# EasyEDA schematic 1-Schematic_final 7.3d.json
TITLE: Sheet_1; REV: 1.0; Date: 2021-05-28; Sheet: 1/1; Drawn By: Kushan Arampath; Company: Your Company
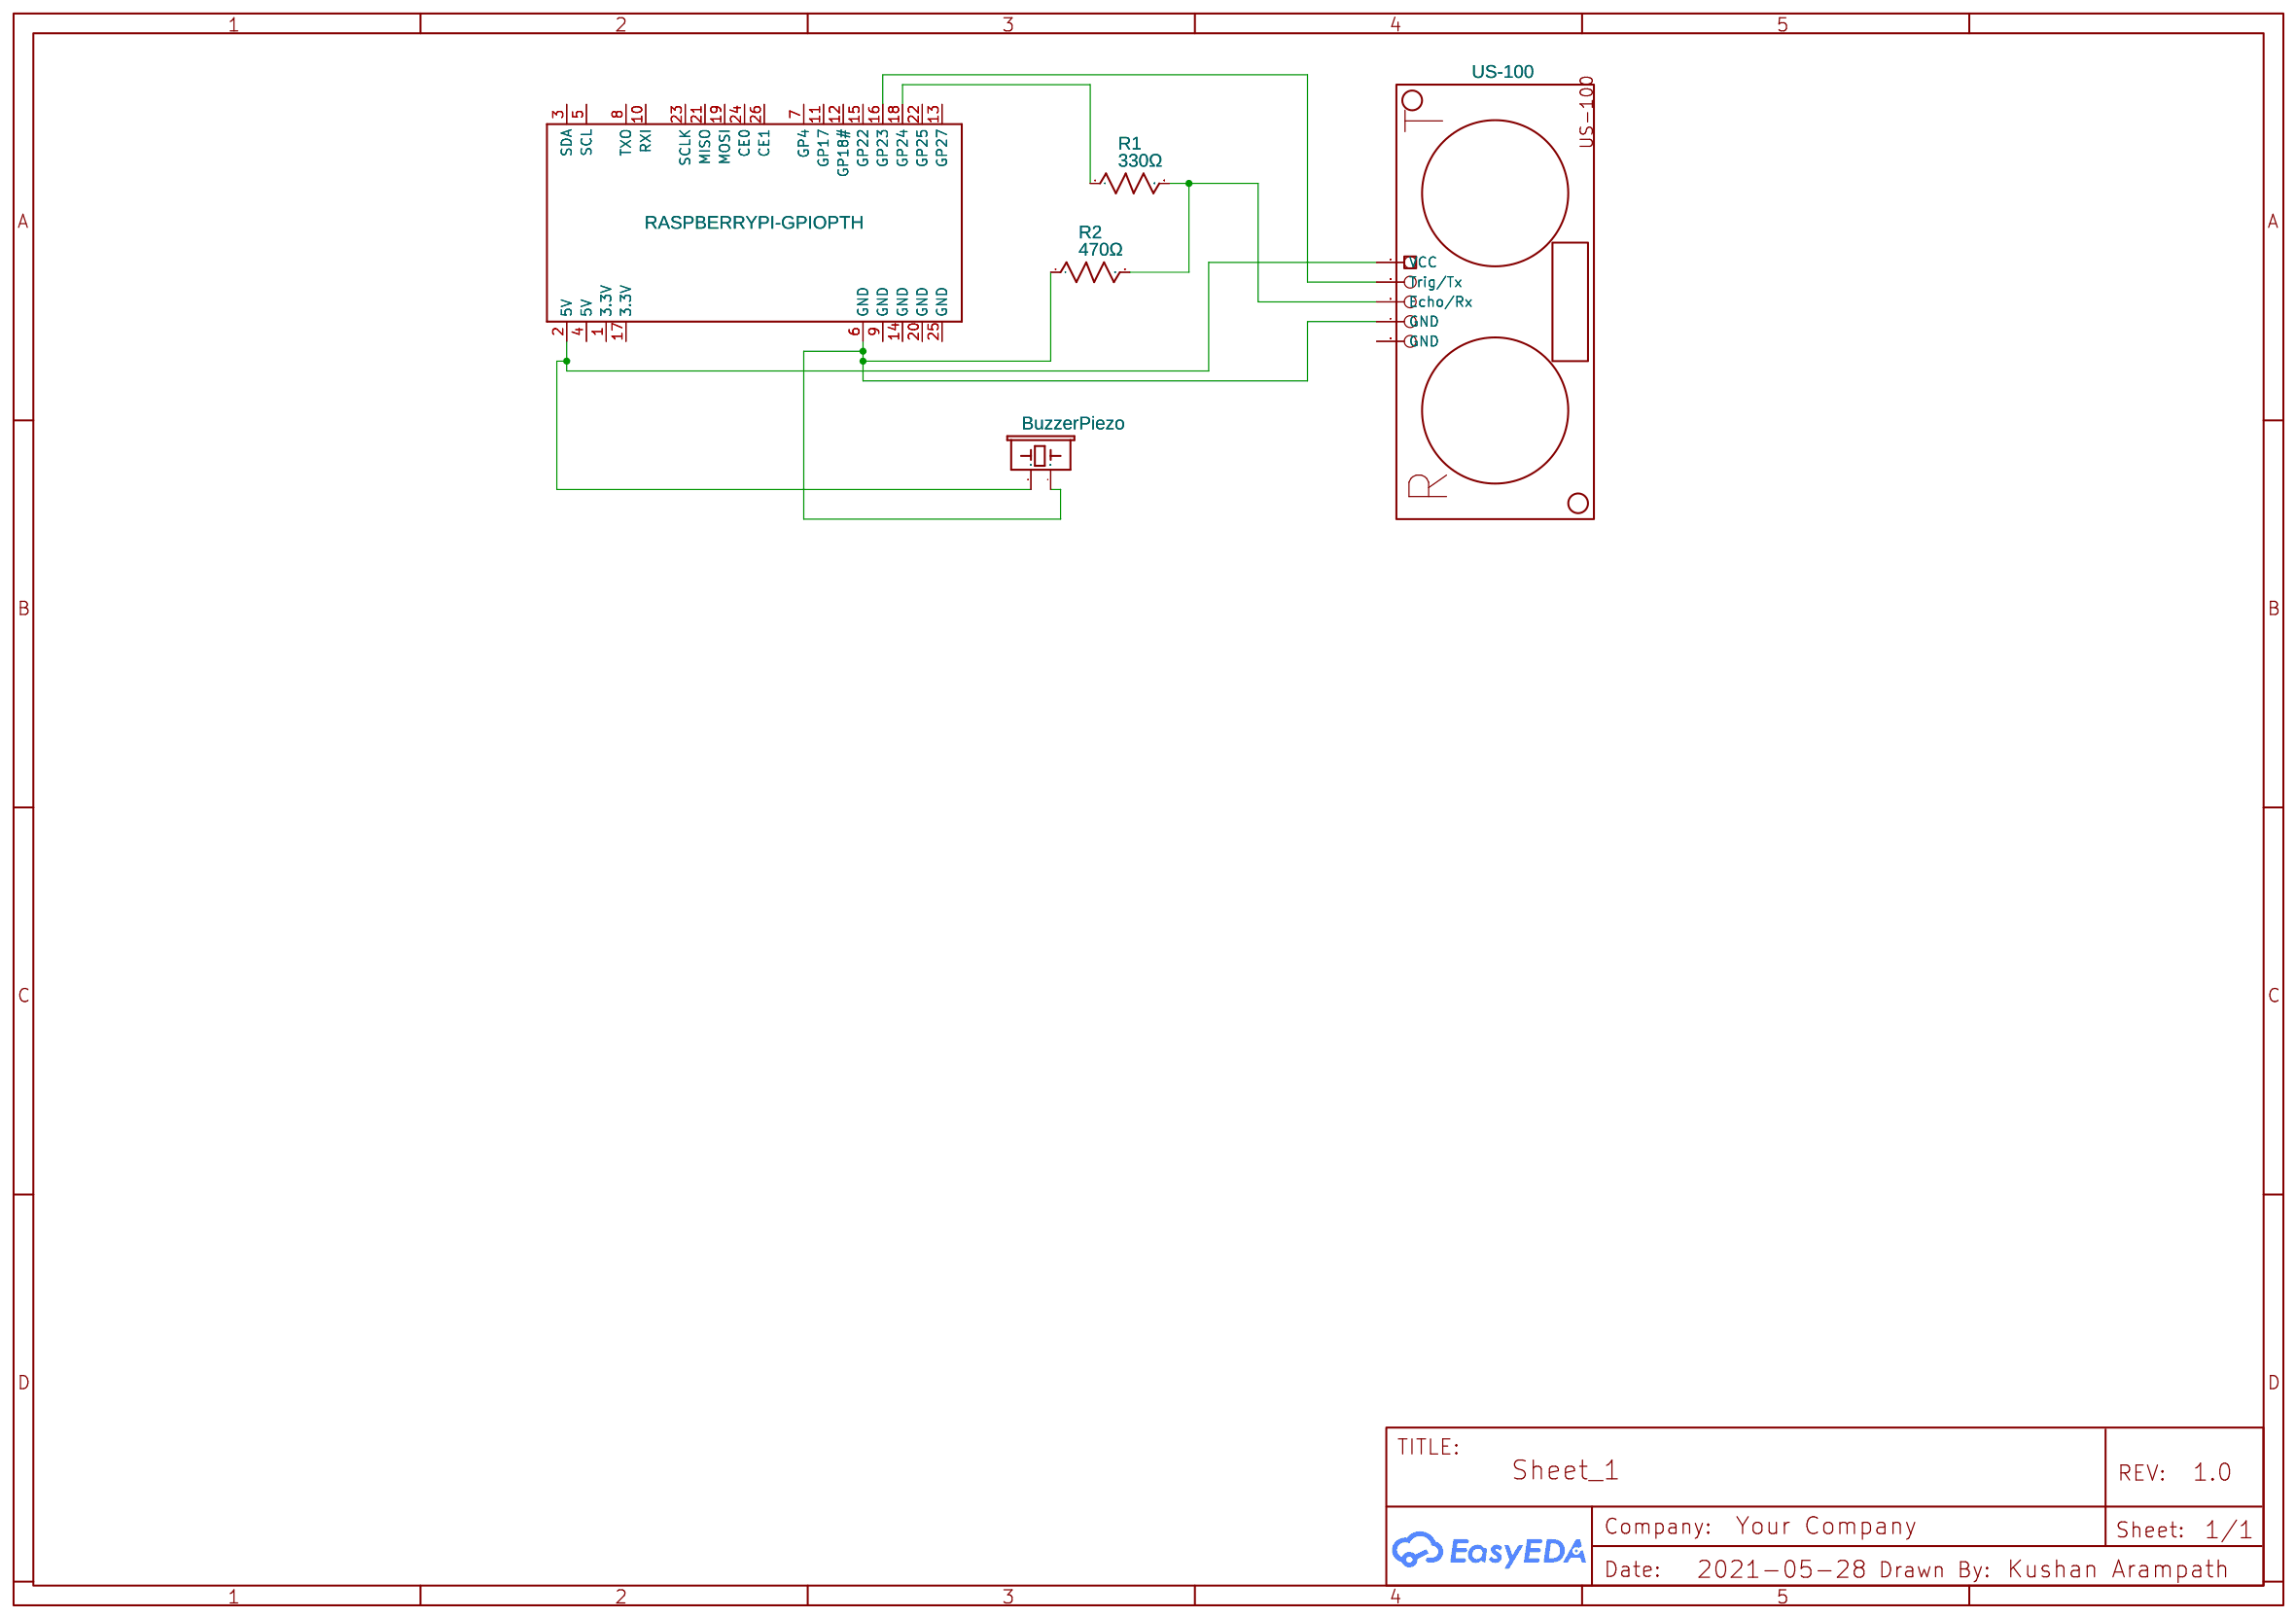
[diagram p0: schematic sheet]

## Parts
JP1  RASPBERRYPI-GPIOPTH  [2X13-SHROUDED]
R1  330Ω  [R0603]
R2  470Ω  [R0603]
SG1  BuzzerPiezo  [BUZZER-CCV-KIT]
U1  US-100  [HEADER_PRG_1X05]

## Library data of the parts
JP1 = RASPBERRYPI-GPIOPTH: RASPBERRY PI IO HEADER; Contributor: SparkFun
R1 R2 = R_0603_US: Contributor: LCEDA_Lib
SG1 = BUZZERSMD2-KIT: Buzzer 12mm; Contributor: SparkFun
U1 = US-100: Manufacturer Part: --; Contributor: adelan92; Supplier Part: --; Manufacturer: Generic; link: http://www.yourduino.com/sunshop/index.php?l=product_detail&p=121

## Nets
Net-(JP1-2): JP1.2(5V) SG1.+(1) U1.1(VCC)
Net-(JP1-6): JP1.6(GND) R2.1 SG1.-(2) U1.4(GND)
Net-(JP1-16): JP1.16(GP23) U1.2(Trig/Tx)
Net-(JP1-18): JP1.18(GP24) R1.1
Net-(R1-2): R1.2 R2.2 U1.3(Echo/Rx)

Not connected (* = marked no-connect by the designer): JP1 1(3.3V) 3(SDA) 4(5V) 5(SCL) 7(GP4) 8(TXO) 9(GND) 10(RXI) 11(GP17) 12(GP18#) 13(GP27) 14(GND) 15(GP22) 17(3.3V) 19(MOSI) 20(GND) 21(MISO) 22(GP25) 23(SCLK) 24(CE0) 25(GND) 26(CE1); U1 5(GND)
